# Altium schematic sheet SerialLineShiftRegs.SchDoc
size A; SheetNumber: 24; SheetTotal: 24
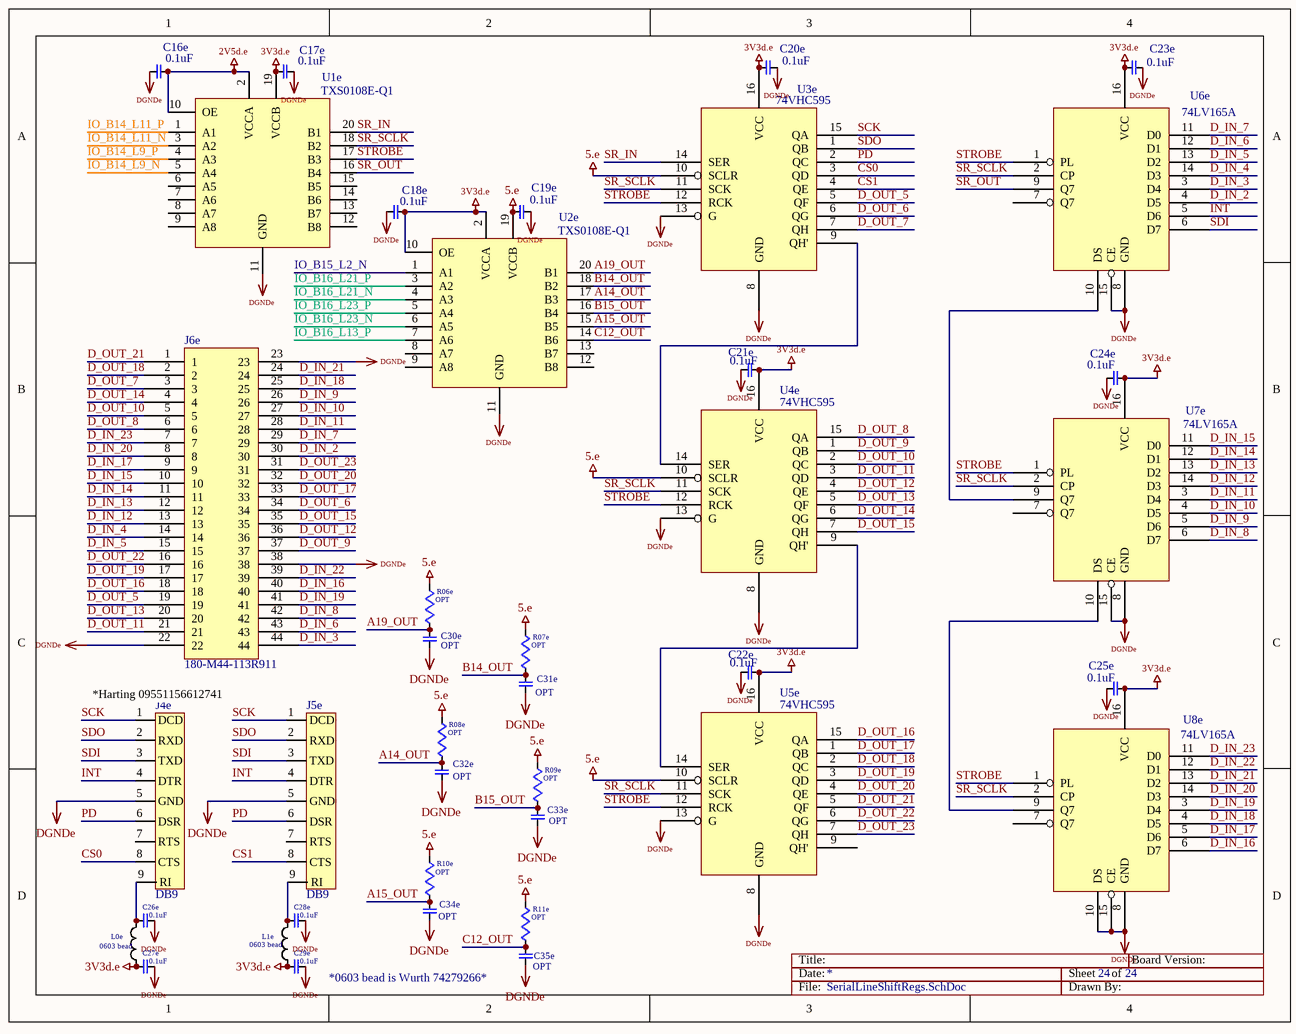
[diagram p0: SerialLineShiftRegs.SchDoc]

## Parts
C16e  0.1uF  [0603]
C17e  0.1uF  [0603]
C18e  0.1uF  [0603]
C19e  0.1uF  [0603]
C20e  0.1uF  [0603]
C21e  0.1uF  [0603]
C22e  0.1uF  [0603]
C23e  0.1uF  [0603]
C24e  0.1uF  [0603]
C25e  0.1uF  [0603]
C26e  0.1uF  [0603]
C27e  0.1uF  [0603]
C28e  0.1uF  [0603]
C29e  0.1uF  [0603]
C30e  OPT  [0603]
C31e  OPT  [0603]
C32e  OPT  [0603]
C33e  OPT  [0603]
C34e  OPT  [0603]
C35e  OPT  [0603]
J4e  DB9  [9-Pin_D-Connector_SMT]
J5e  DB9  [9-Pin_D-Connector_SMT]
J6e  180-M44-113R911  [180-M44-213R911]
L0e  0603 bead  [0603]
L1e  0603 bead  [0603]
R06e  OPT  [0603]
R07e  OPT  [0603]
R08e  OPT  [0603]
R09e  OPT  [0603]
R10e  OPT  [0603]
R11e  OPT  [0603]
U1e  TXS0108E-Q1  [R-PDSO-G20]
U2e  TXS0108E-Q1  [R-PDSO-G20]
U3e  74VHC595  [16TSSOP]
U4e  74VHC595  [16TSSOP]
U5e  74VHC595  [16TSSOP]
U6e  74LV165A  [16TSSOP]
U7e  74LV165A  [16TSSOP]
U8e  74LV165A  [16TSSOP]

## Nets
2V5d.e: C16e.1 U1e.2(VCCA) U1e.10(OE)
3V3d.e: C17e.2 C18e.1 C20e.2 C21e.1 C22e.1 C23e.2 C24e.1 C25e.1 C27e.2 C29e.2 L0e.1 L1e.1 U1e.19(VCCB) U2e.2(VCCA) U2e.10(OE) U3e.16(VCC) U4e.16(VCC) U5e.16(VCC) U6e.16(VCC) U7e.16(VCC) U8e.16(VCC)
5.e: C19e.2 R06e.1 R07e.1 R08e.1 R09e.1 R10e.1 R11e.1 U2e.19(VCCB) U3e.10(SCLR) U4e.10(SCLR) U5e.10(SCLR)
DGNDe: C16e.2 C17e.1 C18e.2 C19e.1 C20e.1 C21e.2 C22e.2 C23e.1 C24e.2 C25e.2 C26e.1 C27e.1 C28e.1 C29e.1 C30e.2 C31e.2 C32e.2 C33e.2 C34e.2 C35e.2 J4e.5(GND) J5e.5(GND) J6e.22 J6e.23 J6e.38 U1e.11(GND) U2e.11(GND) U3e.8(GND) U3e.13(G) U4e.8(GND) U4e.13(G) U5e.8(GND) U5e.13(G) U6e.8(GND) U6e.15(CE) U7e.8(GND) U7e.15(CE) U8e.8(GND) U8e.10(DS) U8e.15(CE)
A14_OUT: C32e.1 R08e.2 U2e.17(B3)
A15_OUT: C34e.1 R10e.2 U2e.15(B5)
A19_OUT: C30e.1 R06e.2 U2e.20(B1)
B14_OUT: C31e.1 R07e.2 U2e.18(B2)
B15_OUT: C33e.1 R09e.2 U2e.16(B4)
C12_OUT: C35e.1 R11e.2 U2e.14(B6)
CS0: J4e.8(CTS) U3e.3(QD)
CS1: J5e.8(CTS) U3e.4(QE)
D_IN_2: J6e.30 U6e.4(D5)
D_IN_3: J6e.44 U6e.3(D4)
D_IN_4: J6e.14 U6e.14(D3)
D_IN_5: J6e.15 U6e.13(D2)
D_IN_6: J6e.43 U6e.12(D1)
D_IN_7: J6e.29 U6e.11(D0)
D_IN_8: J6e.42 U7e.6(D7)
D_IN_9: J6e.26 U7e.5(D6)
D_IN_10: J6e.27 U7e.4(D5)
D_IN_11: J6e.28 U7e.3(D4)
D_IN_12: J6e.13 U7e.14(D3)
D_IN_13: J6e.12 U7e.13(D2)
D_IN_14: J6e.11 U7e.12(D1)
D_IN_15: J6e.10 U7e.11(D0)
D_IN_16: J6e.40 U8e.6(D7)
D_IN_17: J6e.9 U8e.5(D6)
D_IN_18: J6e.25 U8e.4(D5)
D_IN_19: J6e.41 U8e.3(D4)
D_IN_20: J6e.8 U8e.14(D3)
D_IN_21: J6e.24 U8e.13(D2)
D_IN_22: J6e.39 U8e.12(D1)
D_IN_23: J6e.7 U8e.11(D0)
D_OUT_5: J6e.19 U3e.5(QF)
D_OUT_6: J6e.34 U3e.6(QG)
D_OUT_7: J6e.3 U3e.7(QH)
D_OUT_8: J6e.6 U4e.15(QA)
D_OUT_9: J6e.37 U4e.1(QB)
D_OUT_10: J6e.5 U4e.2(QC)
D_OUT_11: J6e.21 U4e.3(QD)
D_OUT_12: J6e.36 U4e.4(QE)
D_OUT_13: J6e.20 U4e.5(QF)
D_OUT_14: J6e.4 U4e.6(QG)
D_OUT_15: J6e.35 U4e.7(QH)
D_OUT_16: J6e.18 U5e.15(QA)
D_OUT_17: J6e.33 U5e.1(QB)
D_OUT_18: J6e.2 U5e.2(QC)
D_OUT_19: J6e.17 U5e.3(QD)
D_OUT_20: J6e.32 U5e.4(QE)
D_OUT_21: J6e.1 U5e.5(QF)
D_OUT_22: J6e.16 U5e.6(QG)
D_OUT_23: J6e.31 U5e.7(QH)
INT: J4e.4(DTR) J5e.4(DTR) U6e.5(D6)
IO_B14_L9_N: U1e.5(A4)
IO_B14_L9_P: U1e.4(A3)
IO_B14_L11_N: U1e.3(A2)
IO_B14_L11_P: U1e.1(A1)
IO_B15_L2_N: U2e.1(A1)
IO_B16_L13_P: U2e.7(A6)
IO_B16_L21_N: U2e.4(A3)
IO_B16_L21_P: U2e.3(A2)
IO_B16_L23_N: U2e.6(A5)
IO_B16_L23_P: U2e.5(A4)
PD: J4e.6(DSR) J5e.6(DSR) U3e.2(QC)
SCK: J4e.1(DCD) J5e.1(DCD) U3e.15(QA)
SDI: J4e.3(TXD) J5e.3(TXD) U6e.6(D7)
SDO: J4e.2(RXD) J5e.2(RXD) U3e.1(QB)
SR_IN: U1e.20(B1) U3e.14(SER)
SR_OUT: U1e.16(B4) U6e.9(Q7)
SR_SCLK: U1e.18(B2) U3e.11(SCK) U4e.11(SCK) U5e.11(SCK) U6e.2(CP) U7e.2(CP) U8e.2(CP)
STROBE: U1e.17(B3) U3e.12(RCK) U4e.12(RCK) U5e.12(RCK) U6e.1(PL) U7e.1(PL) U8e.1(PL)
NetC26e_2: C26e.2 J4e.9(RI) L0e.2
NetC28e_2: C28e.2 J5e.9(RI) L1e.2
NetU3e_9: U3e.9(QH') U4e.14(SER)
NetU4e_9: U4e.9(QH') U5e.14(SER)
NetU6e_10: U6e.10(DS) U7e.9(Q7)
NetU7e_10: U7e.10(DS) U8e.9(Q7)

Not connected (* = marked no-connect by the designer): J4e 7(RTS); J5e 7(RTS); U1e 6(A5) 7(A6) 8(A7) 9(A8) 12(B8) 13(B7) 14(B6) 15(B5); U2e 8(A7) 9(A8) 12(B8) 13(B7); U5e 9(QH'); U6e 7(Q7); U7e 7(Q7); U8e 7(Q7)

## Notes on the sheet
- (near J4e) *Harting 09551156612741
- *0603 bead is Wurth 74279266*
- Title:
- Date:
- Sheet
- of
- Board Version:
- File:
- Drawn By:

## Library data of the parts
C16e C17e C18e C19e C20e C21e C22e C23e C24e C25e C26e C27e C28e C29e C30e C31e C32e C33e C34e C35e = CAP
J6e = DSUB44
L0e L1e = INDUCTOR
R06e R07e R08e R09e R10e R11e = RES
U1e U2e = 8BitLevelShifter